# Altium schematic sheet WT2_MCU.SchDoc
size A4
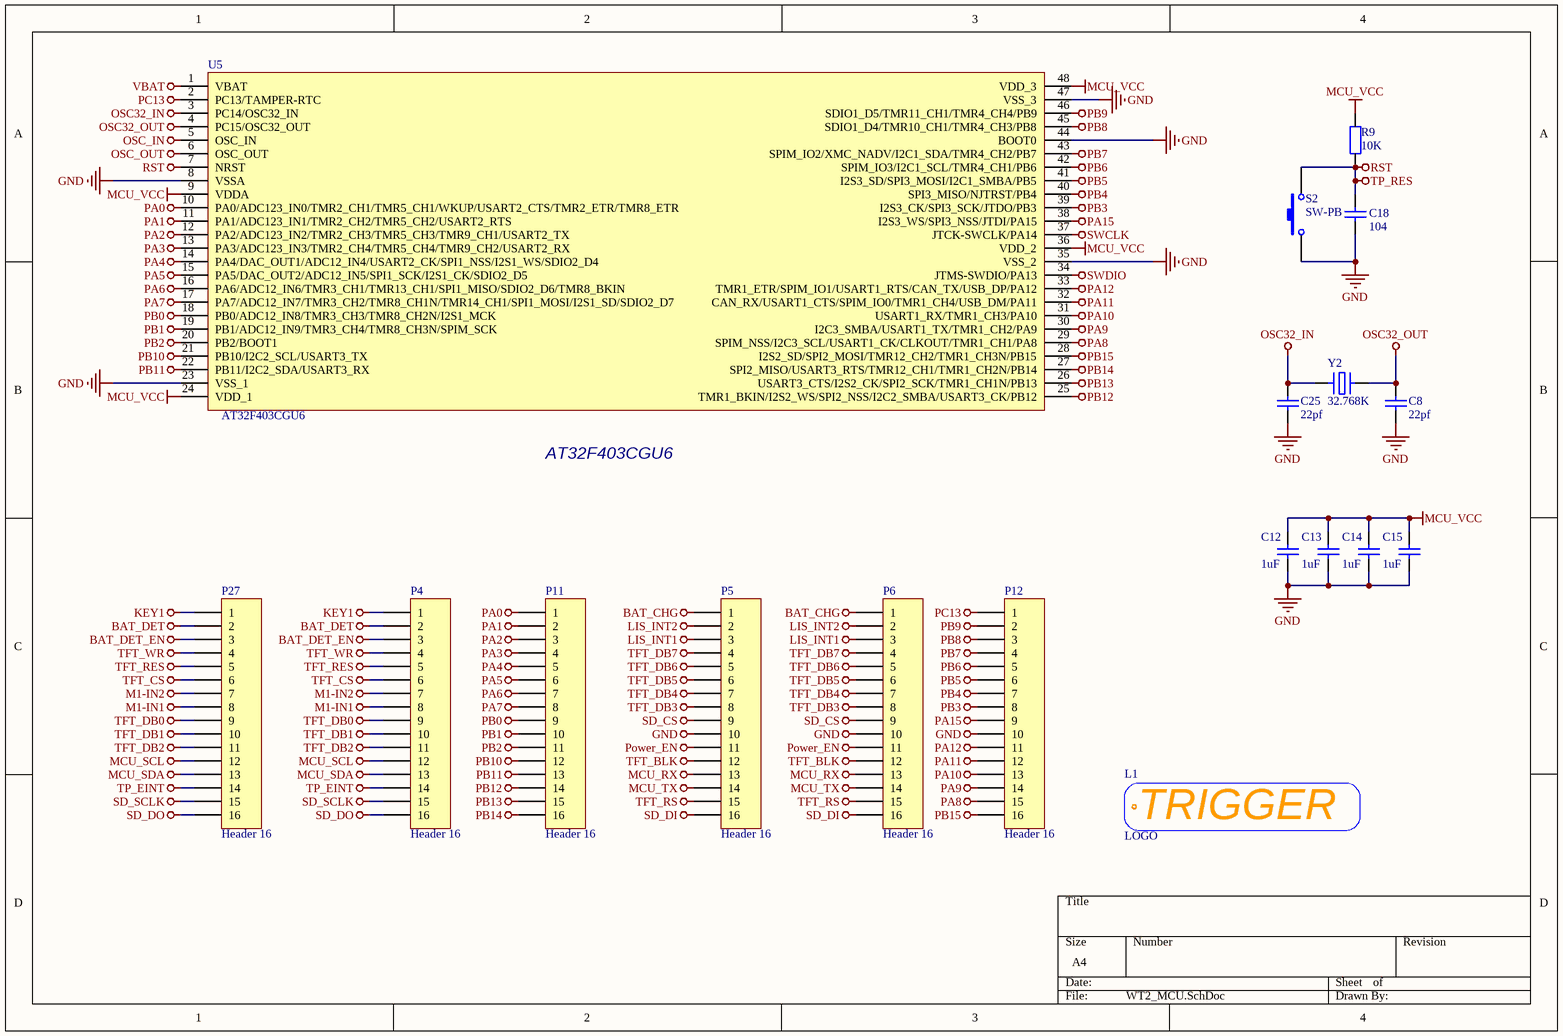
[diagram p0: WT2_MCU.SchDoc]

## Parts
C8  22pf  [电容_C0603]
C12  1uF  [电容_C0603]
C13  1uF  [电容_C0603]
C14  1uF  [电容_C0603]
C15  1uF  [电容_C0603]
C18  104  [电容_C0603]
C25  22pf  [电容_C0603]
L1  LOGO  [LOGO L BS]
P4  Header 16  [HDR1X16]
P5  Header 16  [HDR1X16]
P6  Header 16  [HDR1X16]
P11  Header 16  [HDR1X16]
P12  Header 16  [HDR1X16]
P27  Header 16  [HDR1X16]
R9  10K  [电阻_R0603]
S2  SW-PB  [KEY_6*6mm]
U5  AT32F403CGU6  [AT主控_QFN48(6X6)]
Y2  32.768K  [晶振_3215]

## Nets
BAT_CHG: P5.1 P6.1
BAT_DET: P4.2 P27.2
BAT_DET_EN: P4.3 P27.3
GND: C8.2 C12.1 C13.1 C14.1 C15.1 C18.1 C25.2 P5.10 P6.10 P12.10 S2.1 U5.0(VSS) U5.8(VSSA) U5.23(VSS_1) U5.35(VSS_2) U5.44(BOOT0) U5.47(VSS_3)
KEY1: P4.1 P27.1
LIS_INT1: P5.3 P6.3
LIS_INT2: P5.2 P6.2
M1-IN1: P4.8 P27.8
M1-IN2: P4.7 P27.7
MCU_RX: P5.13 P6.13
MCU_SCL: P4.12 P27.12
MCU_SDA: P4.13 P27.13
MCU_TX: P5.14 P6.14
MCU_VCC: C12.2 C13.2 C14.2 C15.2 R9.2 U5.9(VDDA) U5.24(VDD_1) U5.36(VDD_2) U5.48(VDD_3)
OSC32_IN: C25.1 U5.3(PC14/OSC32_IN) Y2.1
OSC32_OUT: C8.1 U5.4(PC15/OSC32_OUT) Y2.2
OSC_IN: U5.5(OSC_IN)
OSC_OUT: U5.6(OSC_OUT)
PA0: P11.1 U5.10(PA0/ADC123_IN0/TMR2_CH1/TMR5_CH1/WKUP/USART2_CTS/TMR2_ETR/TMR8_ETR)
PA1: P11.2 U5.11(PA1/ADC123_IN1/TMR2_CH2/TMR5_CH2/USART2_RTS)
PA2: P11.3 U5.12(PA2/ADC123_IN2/TMR2_CH3/TMR5_CH3/TMR9_CH1/USART2_TX)
PA3: P11.4 U5.13(PA3/ADC123_IN3/TMR2_CH4/TMR5_CH4/TMR9_CH2/USART2_RX)
PA4: P11.5 U5.14(PA4/DAC_OUT1/ADC12_IN4/USART2_CK/SPI1_NSS/I2S1_WS/SDIO2_D4)
PA5: P11.6 U5.15(PA5/DAC_OUT2/ADC12_IN5/SPI1_SCK/I2S1_CK/SDIO2_D5)
PA6: P11.7 U5.16(PA6/ADC12_IN6/TMR3_CH1/TMR13_CH1/SPI1_MISO/SDIO2_D6/TMR8_BKIN)
PA7: P11.8 U5.17(PA7/ADC12_IN7/TMR3_CH2/TMR8_CH1N/TMR14_CH1/SPI1_MOSI/I2S1_SD/SDIO2_D7)
PA8: P12.15 U5.29(SPIM_NSS/I2C3_SCL/USART1_CK/CLKOUT/TMR1_CH1/PA8)
PA9: P12.14 U5.30(I2C3_SMBA/USART1_TX/TMR1_CH2/PA9)
PA10: P12.13 U5.31(USART1_RX/TMR1_CH3/PA10)
PA11: P12.12 U5.32(CAN_RX/USART1_CTS/SPIM_IO0/TMR1_CH4/USB_DM/PA11)
PA12: P12.11 U5.33(TMR1_ETR/SPIM_IO1/USART1_RTS/CAN_TX/USB_DP/PA12)
PA15: P12.9 U5.38(I2S3_WS/SPI3_NSS/JTDI/PA15)
PB0: P11.9 U5.18(PB0/ADC12_IN8/TMR3_CH3/TMR8_CH2N/I2S1_MCK)
PB1: P11.10 U5.19(PB1/ADC12_IN9/TMR3_CH4/TMR8_CH3N/SPIM_SCK)
PB2: P11.11 U5.20(PB2/BOOT1)
PB3: P12.8 U5.39(I2S3_CK/SPI3_SCK/JTDO/PB3)
PB4: P12.7 U5.40(SPI3_MISO/NJTRST/PB4)
PB5: P12.6 U5.41(I2S3_SD/SPI3_MOSI/I2C1_SMBA/PB5)
PB6: P12.5 U5.42(SPIM_IO3/I2C1_SCL/TMR4_CH1/PB6)
PB7: P12.4 U5.43(SPIM_IO2/XMC_NADV/I2C1_SDA/TMR4_CH2/PB7)
PB8: P12.3 U5.45(SDIO1_D4/TMR10_CH1/TMR4_CH3/PB8)
PB9: P12.2 U5.46(SDIO1_D5/TMR11_CH1/TMR4_CH4/PB9)
PB10: P11.12 U5.21(PB10/I2C2_SCL/USART3_TX)
PB11: P11.13 U5.22(PB11/I2C2_SDA/USART3_RX)
PB12: P11.14 U5.25(TMR1_BKIN/I2S2_WS/SPI2_NSS/I2C2_SMBA/USART3_CK/PB12)
PB13: P11.15 U5.26(USART3_CTS/I2S2_CK/SPI2_SCK/TMR1_CH1N/PB13)
PB14: P11.16 U5.27(SPI2_MISO/USART3_RTS/TMR12_CH1/TMR1_CH2N/PB14)
PB15: P12.16 U5.28(I2S2_SD/SPI2_MOSI/TMR12_CH2/TMR1_CH3N/PB15)
PC13: P12.1 U5.2(PC13/TAMPER-RTC)
Power_EN: P5.11 P6.11
RST: C18.2 R9.1 S2.2 U5.7(NRST)  [also labelled TP_RES]
SD_CS: P5.9 P6.9
SD_DI: P5.16 P6.16
SD_DO: P4.16 P27.16
SD_SCLK: P4.15 P27.15
SWCLK: U5.37(JTCK-SWCLK/PA14)
SWDIO: U5.34(JTMS-SWDIO/PA13)
TFT_BLK: P5.12 P6.12
TFT_CS: P4.6 P27.6
TFT_DB0: P4.9 P27.9
TFT_DB1: P4.10 P27.10
TFT_DB2: P4.11 P27.11
TFT_DB3: P5.8 P6.8
TFT_DB4: P5.7 P6.7
TFT_DB5: P5.6 P6.6
TFT_DB6: P5.5 P6.5
TFT_DB7: P5.4 P6.4
TFT_RES: P4.5 P27.5
TFT_RS: P5.15 P6.15
TFT_WR: P4.4 P27.4
TP_EINT: P4.14 P27.14
VBAT: U5.1(VBAT)

## Notes on the sheet
- (near U5) AT32F403CGU6
- (in symbol LOGO_TRIGGER) TRIGGER

## Library data of the parts
C8 C12-C15 C18 C25 = cap: U: 50V; 参数: Cap,0805,X7R,104K,50V,125C,±10%
  C8 C25: C: 22pf
  C12-C15: C: 1uF
  C18: C: 104
L1 = LOGO_TRIGGER
P4-P6 P11 P12 P27 = Header 16: Header, 16-Pin; LatestRevisionDate: 17-Jul-2002; LatestRevisionNote: Re-released for DXP Platform.; Publisher: Altium Limited
R9 = Res: P: 1/8W; 参数: Res,0805,0R,±1%,1/8W,100ppm,155C; R: 10K
S2 = SW-PB: 按键
U5 = AT32F403CGU6: _Footprint: QFN48; _Comma: ,; _Name: MCU; _Specification: MCU,AT32F403CGU6,QFN48; _Model: AT32F403CGU6
Y2 = XTAL_A: _Name: CRYSTALS; _Comma: ,; _Specification: CRYSTALS,32.768K,*,10ppm,12pF; _Accuracy: 10ppm; _CL: 12pF; _Footprint: *; _Frequency: 32.768K